# Altium project 2018_PanneauDomotiqueSimple.PrjPcb
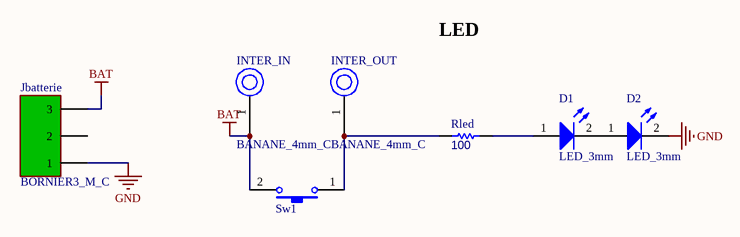
[diagram p0: 2018_PanneauDomotiqueSimple.SchDoc]
1 sheet, 7 parts. Net scope: global (net labels, ports and power ports of the same name join across sheets).
Board file: 2018_PanneauDomotiqueSimple.PcbDoc

## Sheet 2018_PanneauDomotiqueSimple.SchDoc
size A4

### Parts
D1  LED_3MM  [LED_3MM]
D2  LED_3MM  [LED_3MM]
INTER_IN  Type: BANANE_4mm_C  [DOUILLE_BANANE_4MM_COUDEE]  (hidden comment: DOUILLE BANANE 4mm COUDEE)
INTER_OUT  Type: BANANE_4mm_C  [DOUILLE_BANANE_4MM_COUDEE]  (hidden comment: DOUILLE BANANE 4mm COUDEE)
Jbatterie  BORNIER3 MALE COUDE  [BORNIER3_M_C]  (value not drawn)
Rled  value 100  [RESISTANCE_1/4W]  (hidden comment: RESISTANCE_AXIALE_1/4W)
Sw1  BOUTON_POUSSOIR_MINIATURE_TRAVERSANT  [BOUTON_POUSSE_PLAT_6x6]  (value not drawn)

### Nets
BAT: INTER_IN.1 Jbatterie.3 Sw1.2
GND: D2.2 Jbatterie.1
NetD1_1: D1.1 Rled.2
NetD1_2: D1.2 D2.1
NetINTER_OUT_1: INTER_OUT.1 Rled.1 Sw1.1

Not connected (* = marked no-connect by the designer): Jbatterie 2

### Notes on the sheet
- LED

### Library data of the parts
D1 D2 = LED_3MM: LED 3MM - ROUGE/VERTE/JAUNE; Type: LED_3mm
INTER_IN INTER_OUT = DOUILLE_BANANE_4mm_COUDEE: DOUILLE BANANE 4 mm COUDEE
Jbatterie = BORNIER3_MALE_COUDE: BORNIER 3 PLOTS MALE COUDE - ENFICHAGE PARALLELE; Type: BORNIER3_M_C
Rled = RESISTANCE_AXIALE_1/4W: RESISTANCE TRAVERSANTE AXIALE 1/4W; Type: 1/4W
Sw1 = BOUTON_POUSSOIR_MINIATURE_TRAVERSANT: BOUTON POUSSOIR MINIATURE TRAVERSANT ON/OFF; Type: B_POUSS_MINI_T